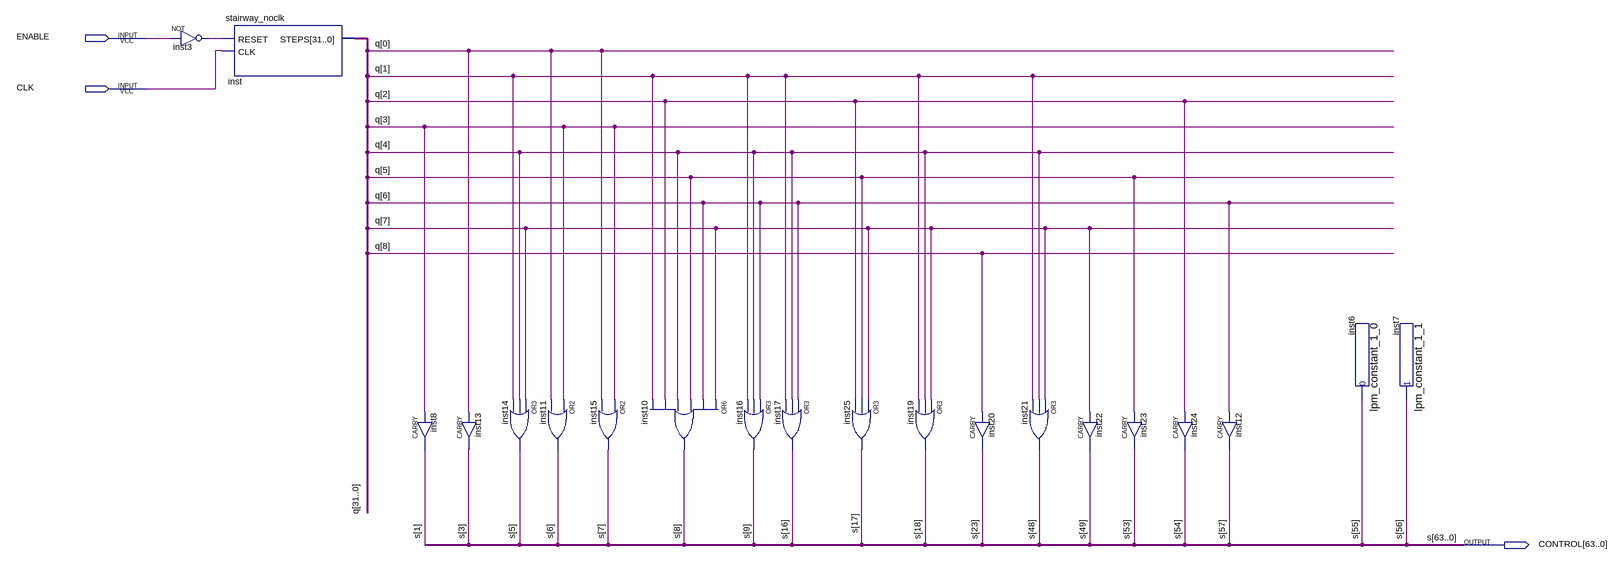
[diagram p0: schematic sheet]
// Quartus schematic macro_or.bdf as structural Verilog: 20 symbols, 3 pins
module macro_or (
  input  ENABLE,
  input  CLK,
  output [63:0] CONTROL
);

  wire inst3_out;
  wire [31:0] q;

  not inst3 (inst3_out, ENABLE);
  stairway_noclk inst (.RESET(inst3_out), .CLK(CLK), .STEPS(q));
  CARRY inst8 (.IN(q[3]), .OUT(CONTROL[1]));
  CARRY inst13 (.IN(q[0]), .OUT(CONTROL[3]));
  or inst14 (CONTROL[5], q[7], q[4], q[1]);
  or inst11 (CONTROL[6], q[3], q[0]);
  or inst15 (CONTROL[7], q[3], q[0]);
  or inst10 (CONTROL[8], q[7], q[6], q[5], q[4], q[2], q[1]);
  or inst16 (CONTROL[9], q[6], q[4], q[1]);
  or inst17 (CONTROL[16], q[6], q[4], q[1]);
  or inst25 (CONTROL[17], q[7], q[5], q[2]);
  or inst19 (CONTROL[18], q[7], q[4], q[1]);
  CARRY inst20 (.IN(q[8]), .OUT(CONTROL[23]));
  or inst21 (CONTROL[48], q[7], q[4], q[1]);
  CARRY inst22 (.IN(q[7]), .OUT(CONTROL[49]));
  CARRY inst23 (.IN(q[5]), .OUT(CONTROL[53]));
  CARRY inst24 (.IN(q[2]), .OUT(CONTROL[54]));
  CARRY inst12 (.IN(q[6]), .OUT(CONTROL[57]));
  lpm_constant_1_0 inst6 (.result(CONTROL[55]));
  lpm_constant_1_1 inst7 (.result(CONTROL[56]));

  // Other names for the same wires on the sheet: s[63:0] = CONTROL
endmodule
